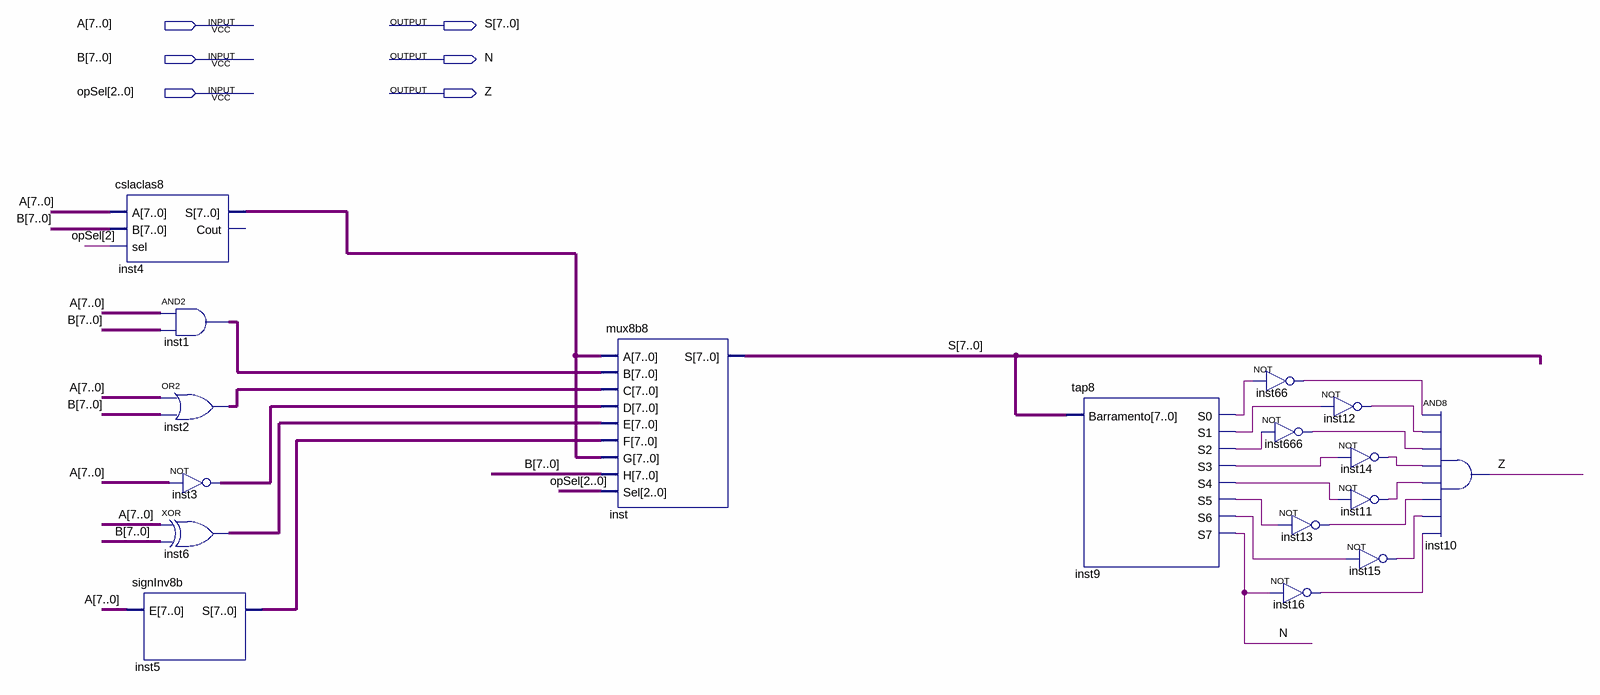
[diagram p0: schematic sheet]
// Quartus schematic ula8bNEANDER.bdf as structural Verilog: 17 symbols, 6 pins
module ula8bNEANDER (
  input  [7:0] A,
  input  [7:0] B,
  input  [2:0] opSel,
  output [7:0] S,
  output N,
  output Z
);

  wire inst9_s0, inst9_s1, inst9_s2, inst9_s3, inst9_s4, inst9_s5, inst9_s6, inst11_out, inst12_out,
       inst13_out, inst14_out, inst15_out, inst16_out, inst66_out, inst666_out;
  wire [7:0] inst1_out, inst2_out, inst3_out, inst4_s, inst5_s, inst6_out;

  cslaclas8 inst4 (.A(A), .B(B), .sel(opSel[2]), .S(inst4_s));  // open: Cout
  signInv8b inst5 (.E(A), .S(inst5_s));
  assign inst1_out = A & B;  // AND2 inst1, 8 bits wide
  assign inst2_out = A | B;  // OR2 inst2, 8 bits wide
  assign inst3_out = ~A;  // NOT inst3, 8 bits wide
  assign inst6_out = A ^ B;  // XOR inst6, 8 bits wide
  mux8b8 inst (
    .A(inst4_s), .B(inst1_out), .C(inst2_out), .D(inst3_out), .E(inst6_out), .F(inst5_s), .G(inst4_s), .H(B),
    .Sel(opSel), .S(S));
  tap8 inst9 (
    .Barramento(S), .S0(inst9_s0), .S1(inst9_s1), .S2(inst9_s2), .S3(inst9_s3), .S4(inst9_s4), .S5(inst9_s5),
    .S6(inst9_s6), .S7(N));
  not inst66 (inst66_out, inst9_s0);
  not inst666 (inst666_out, inst9_s2);
  not inst13 (inst13_out, inst9_s5);
  not inst16 (inst16_out, N);
  not inst12 (inst12_out, inst9_s1);
  not inst14 (inst14_out, inst9_s3);
  not inst11 (inst11_out, inst9_s4);
  not inst15 (inst15_out, inst9_s6);
  and inst10 (Z, inst66_out, inst12_out, inst666_out, inst14_out, inst11_out, inst13_out, inst15_out, inst16_out);
endmodule
